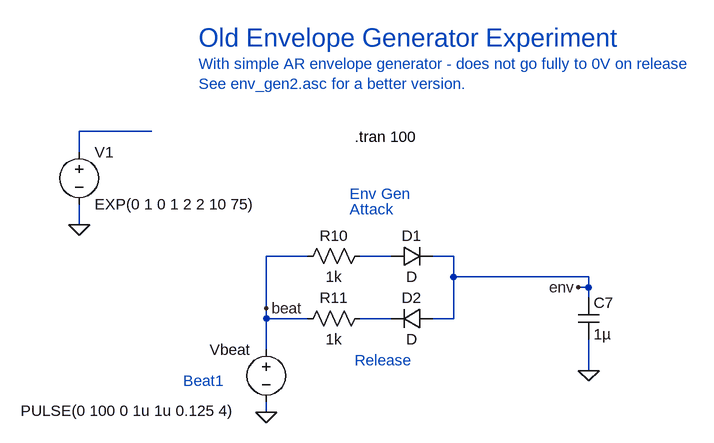
[diagram p0: schematic env_gen.asc]
env_gen.asc, the LTspice schematic file:
Version 4
SHEET 1 1536 820
WIRE -1488 -176 -1600 -176
WIRE -1600 -144 -1600 -176
WIRE -1600 -32 -1600 -64
WIRE -1248 16 -1312 16
WIRE -1120 16 -1168 16
WIRE -1024 16 -1056 16
WIRE -1024 48 -1024 16
WIRE -816 48 -1024 48
WIRE -816 64 -816 48
WIRE -816 64 -832 64
WIRE -816 80 -816 64
WIRE -1312 96 -1312 16
WIRE -1312 112 -1312 96
WIRE -1248 112 -1312 112
WIRE -1120 112 -1168 112
WIRE -1024 112 -1024 48
WIRE -1024 112 -1056 112
WIRE -1312 160 -1312 112
WIRE -816 192 -816 144
WIRE -1312 256 -1312 240
FLAG -1312 256 0
FLAG -1312 96 beat
FLAG -832 64 env
FLAG -816 192 0
FLAG -1600 -32 0
SYMBOL voltage -1312 144 M0
WINDOW 123 24 124 Left 2
WINDOW 39 0 0 Left 2
WINDOW 3 47 110 Left 2
SYMATTR Value PULSE(0 100 0 1u 1u 0.125 4)
SYMATTR InstName Vbeat
SYMBOL res -1152 0 R90
WINDOW 0 0 56 VBottom 2
WINDOW 3 32 56 VTop 2
SYMATTR InstName R10
SYMATTR Value 1k
SYMBOL diode -1120 32 R270
WINDOW 0 32 32 VTop 2
WINDOW 3 0 32 VBottom 2
SYMATTR InstName D1
SYMBOL res -1152 96 R90
WINDOW 0 0 56 VBottom 2
WINDOW 3 32 56 VTop 2
SYMATTR InstName R11
SYMATTR Value 1k
SYMBOL diode -1056 96 R90
WINDOW 0 0 32 VBottom 2
WINDOW 3 32 32 VTop 2
SYMATTR InstName D2
SYMBOL cap -832 80 R0
SYMATTR InstName C7
SYMATTR Value 1µ
SYMBOL voltage -1600 -160 R0
WINDOW 123 0 0 Left 0
WINDOW 39 0 0 Left 0
SYMATTR InstName V1
SYMATTR Value EXP(0 1 0 1 2 2 10 75)
TEXT -1176 -168 Left 2 !.tran 100
TEXT -1440 208 Left 2 ;Beat1
TEXT -1416 -320 Left 4 ;Old Envelope Generator Experiment
TEXT -1184 -56 Left 2 ;Attack
TEXT -1176 176 Left 2 ;Release
TEXT -1184 -80 Left 2 ;Env Gen
TEXT -1416 -280 Left 2 ;With simple AR envelope generator - does not go fully to 0V on release\nSee env_gen2.asc for a better version.

The netlist it stands for:
* env_gen.asc
Vbeat beat 0 PULSE(0 100 0 1u 1u 0.125 4)
R10 N002 beat 1k
D1 N002 env D
R11 N003 beat 1k
D2 env N003 D
C7 env 0 1µ
V1 N001 0 EXP(0 1 0 1 2 2 10 75)
.model D D
.lib standard.dio
.tran 100
* Beat1
* Old Envelope Generator Experiment
* Attack
* Release
* Env Gen
* With simple AR envelope generator - does not go fully to 0V on release
* See env_gen2.asc for a better version.
.backanno
.end